# EAGLE schematic ESP8266_MySensorsGateway_v1.3 (EAGLE 7.5.0)
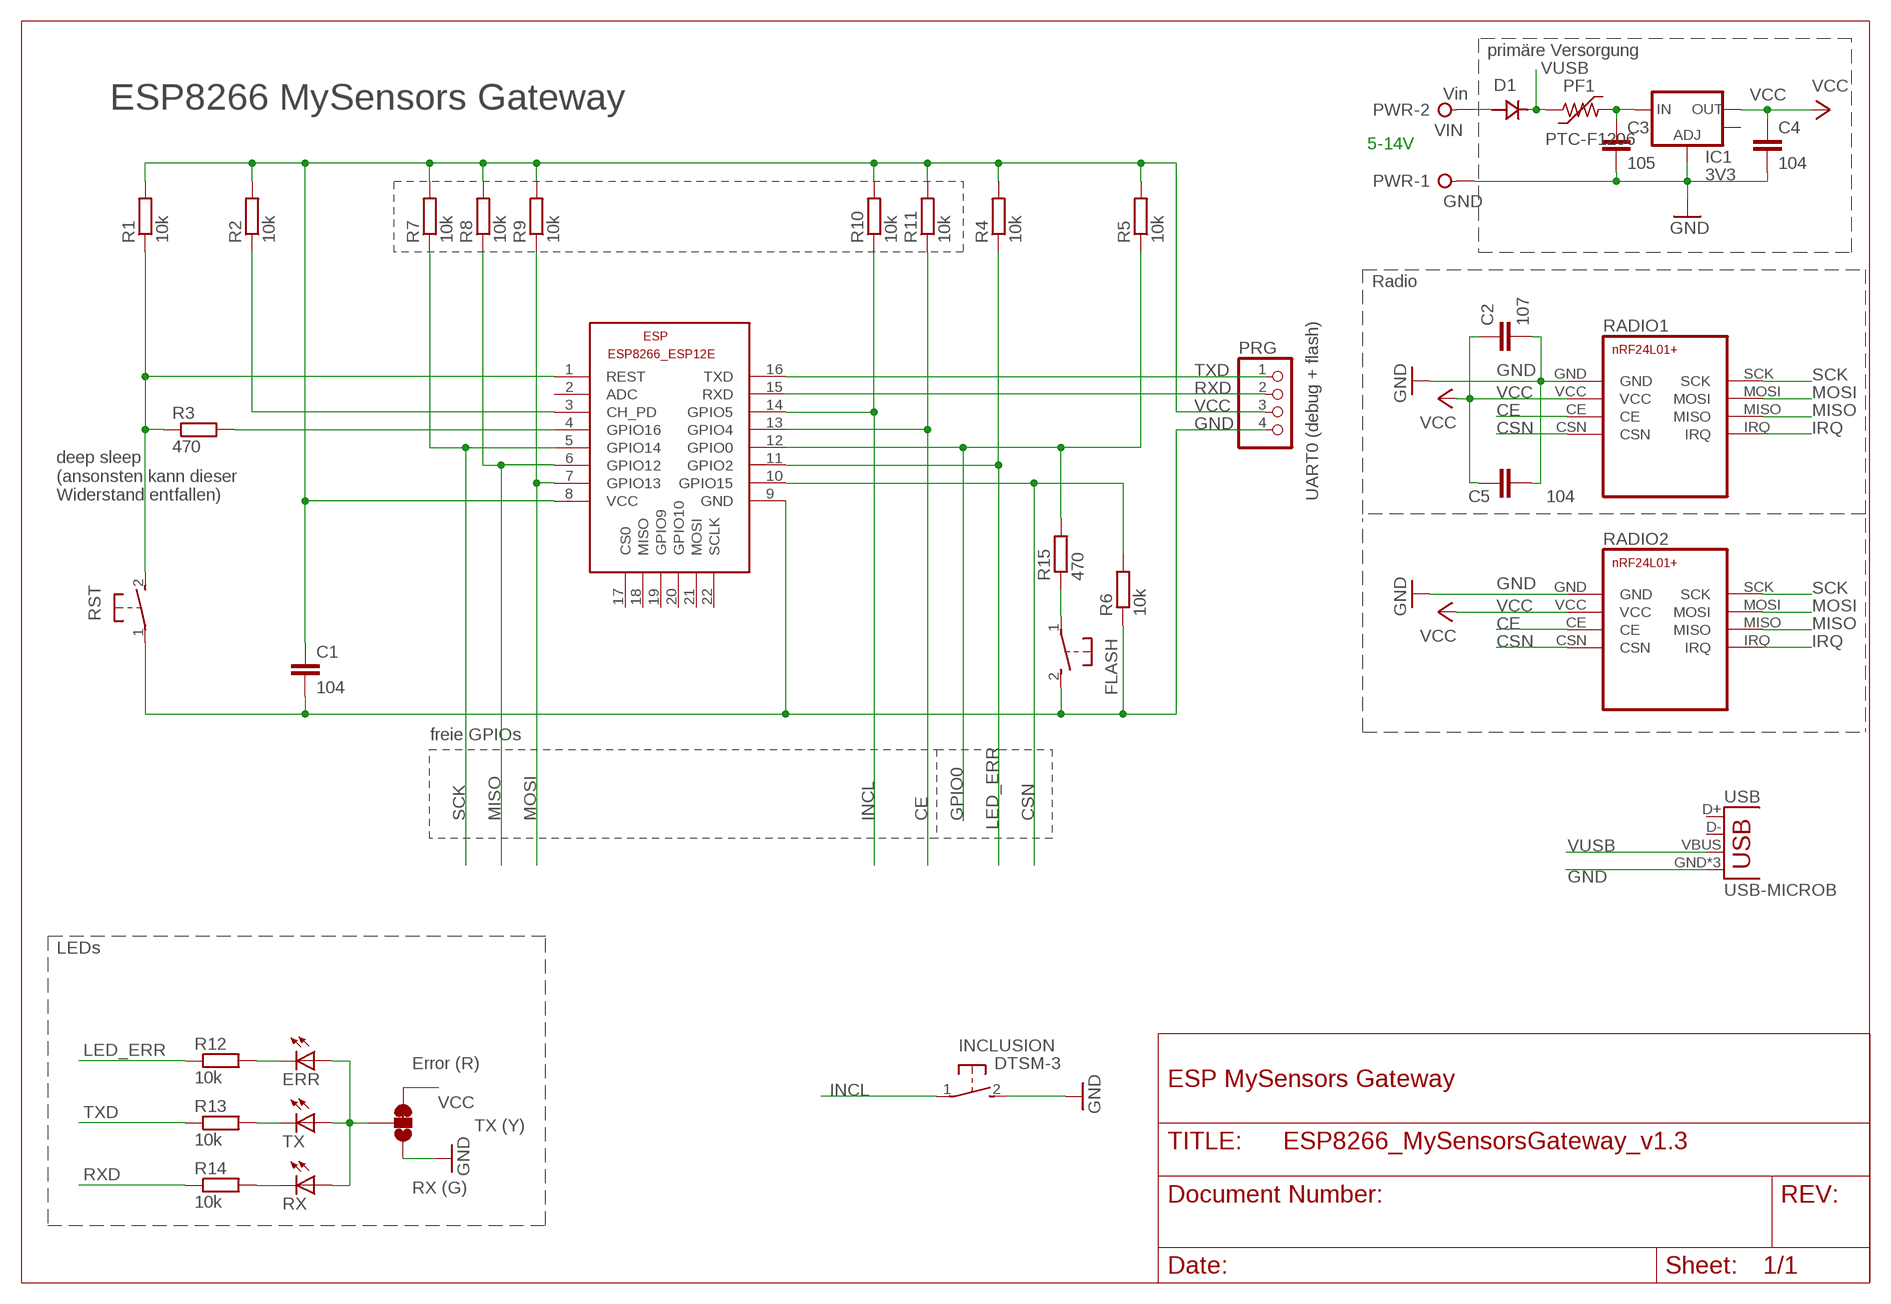
[diagram p0: schematic, sheet 1]

## Parts
C1  104  C-EUC0805  [C0805]
C2  107  C  [MY1210]
C3  105  C-EUC0805  [C0805]
C4  104  C-EUC0805  [C0805]
C5  104  C-EUC0805  [C0805]
D1  SS14  [DO214]
ERR  R  LEDCHIPLED_1206  [CHIPLED_1206]
ESP  µC  ESP8266-12EESP8266-ESP12E  [ESP8266-ESP12E]
FLASH  DTSM-3  [DTSM-3]
IC1  3V3  V_REG_LM1117SOT223  [SOT223]
INCLUSION  DTSM-3  [DTSM-3]
PF1  PTC-F1206  [F1206]
PRG  PINHD-1X4_S  [1X04]
PWR  Vin  W237-02P  [W237-132]
R1  10k  R-EU_R0805  [R0805]
R2  10k  R-EU_R0805  [R0805]
R3  470  R-EU_R0805  [R0805]
R4  10k  R-EU_R0805  [R0805]
R5  10k  R-EU_R0805  [R0805]
R6  10k  R-EU_R0805  [R0805]
R7  10k  R-EU_R0805  [R0805]
R8  10k  R-EU_R0805  [R0805]
R9  10k  R-EU_R0805  [R0805]
R10  10k  R-EU_R0805  [R0805]
R11  10k  R-EU_R0805  [R0805]
R12  10k  R-EU_R0805  [R0805]
R13  10k  R-EU_R0805  [R0805]
R14  10k  R-EU_R0805  [R0805]
R15  470  R-EU_R0805  [R0805]
RADIO1  NRF24L01+  [NRF24L01+]
RADIO2  NRF24L01+NRF24L01+MINI  [NRF24L01+MINI]
RST  DTSM-3  [DTSM-3]
RX  G  LEDCHIPLED_1206  [CHIPLED_1206]
SJ1  JUMPER-PAD-3-2OF3_NC_BY_TRACE_SMALL  [PAD-JUMPER-3-2OF3_NC_BY_TRACE_YES_SILK_FULL_BOX]
TX  Y  LEDCHIPLED_1206  [CHIPLED_1206]
USB  USB-MICROB  [USB-MICROB]

## Nets
CE: ESP.13(GPIO4) R11.1 RADIO1.CE RADIO2.CE
CH_PD: ESP.3(CH_PD) R2.1
CSN: ESP.10(GPIO15) R6.2 RADIO1.CSN RADIO2.CSN
DEEP_SLEEP: ESP.4(GPIO16) R3.2
GND: C1.2 C2.2 C3.2 C4.2 C5.2 ESP.9(GND) FLASH.2 IC1.1(ADJ) INCLUSION.2 PRG.4 PWR.1 R6.1 RADIO1.GND RADIO2.GND RST.1 SJ1.1 USB.GND USB.MT1(GND) USB.MT2(GND)
GPIO0: ESP.12(GPIO0) R5.1 R15.2
INCL: ESP.14(GPIO5) INCLUSION.1 R10.1
IRQ: RADIO1.IRQ RADIO2.IRQ
L_BASE: ERR.A RX.A SJ1.2 TX.A
LED_ERR: ESP.11(GPIO2) R4.1 R12.1
MISO: ESP.6(GPIO12) R8.1 RADIO1.MISO RADIO2.MISO
MOSI: ESP.7(GPIO13) R9.1 RADIO1.MOSI RADIO2.MOSI
N$4: ERR.C R12.2
N$5: R13.2 TX.C
N$6: R14.2 RX.C
N$7: FLASH.1 R15.1
N$10: C3.1 IC1.3(IN) PF1.2
RST: ESP.1(REST) R1.1 R3.1 RST.2
RXD: ESP.15(RXD) PRG.2 R14.1
SCK: ESP.5(GPIO14) R7.1 RADIO1.SCK RADIO2.SCK
TXD: ESP.16(TXD) PRG.1 R13.1
VCC: C1.1 C2.1 C4.1 C5.1 ESP.8(VCC) IC1.2(OUT) PRG.3 R1.2 R2.2 R4.2 R5.2 R7.2 R8.2 R9.2 R10.2 R11.2 RADIO1.VCC RADIO2.VCC SJ1.3
VIN: D1.ANODE PWR.2
VUSB: D1.CATHODE PF1.1 USB.VBUS
Unconnected: ESP.2(ADC) ESP.17(CS0) ESP.18(MISO) ESP.19(GPIO9) ESP.20(GPIO10) ESP.21(MOSI) ESP.22(SCLK) IC1.4(OUT) USB.D+ USB.D-

## Notes on the sheet
- primäre Versorgung
- ESP8266 MySensors Gateway
- 5-14V
- Radio
- deep sleep
  (ansonsten kann dieser 
  Widerstand entfallen)
- UART0 (debug + flash)
- freie GPIOs
- LEDs
- Error (R)
- ESP MySensors Gateway
- TX (Y)
- RX (G)

## Library data of the parts
C1 C3-C5 = resistor:C-EU: CAPACITOR, European symbol
C2 = my:C: CAPACITOR, European symbol
D1 = ihpcb-diode:SS14
ERR RX TX = led:LED: LED OSRAM: - CHIPLED LG R971, LG N971, LY N971, LG Q971, LY Q971, LO R971, LY R971 LH N974, LH R974 LS Q976, LO Q976, LY Q976 LO Q996 - Hyper CHIPLED LW Q18S LB Q993, LB Q99A, LB R99A - SideLED LS A670, LO A670, LY A670, LG A670, LP A670 LB A673, LV A673, LT A673, LW A673 LH A674 LY A675 LS A676, LA A676, LO A676, LY A676, LW A676 LS A679, LY A679, LG A679 - Hyper Micro SIDELED® LS Y876, LA Y876, LO Y876, LY Y876 LT Y87S - SmartLED LW L88C, LW L88S LB L89C, LB L89S, LG L890 LS L89K, LO L89K, LY L89K LS L896, LA L896, LO L896, LY L896 - TOPLED LS T670, LO T670, LY T670, LG T670, LP T670 LSG T670, LSP T670, LSY T670, LOP T670, LYG T670 LG T671, LOG T671, LSG T671 LB T673, LV T673, LT T673, LW T673 LH T674 LS T676, LA T676, LO T676, LY T676, LB T676, LH T676, LSB T676, LW T676 LB T67C, LV T67C, LT T67C, LS T67K, LO T67K, LY T67K, LW E67C LS E67B, LA E67B, LO E67B, LY E67B, LB E67C, LV E67C, LT E67C LW T67C LS T679, LY T679, LG T679 LS T770, LO T770, LY T770, LG T770, LP T770 LB T773, LV T773, LT T773, LW T773 LH T774 LS E675, LA E675, LY E675, LS T675 LS T776, LA T776, LO T776, LY T776, LB T776 LHGB T686 LT T68C, LB T68C - Hyper Mini TOPLED® LB M676 - Mini TOPLED Santana® LG M470 LS M47K, LO M47K, LY M47K Source: http://www.osram.convergy.de LUXEON: - LUMILED® LXK2-PW12-R00, LXK2-PW12-S00, LXK2-PW14-U00, LXK2-PW14-V00 LXK2-PM12-R00, LXK2-PM12-S00, LXK2-PM14-U00 LXK2-PE12-Q00, LXK2-PE12-R00, LXK2-PE12-S00, LXK2-PE14-T00, LXK2-PE14-U00 LXK2-PB12-K00, LXK2-PB12-L00, LXK2-PB12-M00, LXK2-PB14-N00, LXK2-PB14-P00, LXK2-PB14-Q00 LXK2-PR12-L00, LXK2-PR12-M00, LXK2-PR14-Q00, LXK2-PR14-R00 LXK2-PD12-Q00, LXK2-PD12-R00, LXK2-PD12-S00 LXK2-PH12-R00, LXK2-PH12-S00 LXK2-PL12-P00, LXK2-PL12-Q00, LXK2-PL12-R00 Source: www.luxeon.com KINGBRIGHT: KA-3528ASYC Source: www.kingbright.com
ESP = ESP8266-ESP12E:ESP8266-12E: ESP8266-12E with additional I/O and GPIO04/05 corrected The author cannot warrant that this library is free from error or will meet your specific requirements. Created by PuceBaboon.com. Komagane, Nagano, JAPAN
FLASH INCLUSION RST = mechanics:DTSM-3: Diptronics SMD button 6x3.5 mm
IC1 = SparkFun-PowerIC:V_REG_LM1117: Voltage Regulator LM1117 Standard adjustable voltage regulator but in SMD form. Spark Fun Electronics SKU : COM-00595; PROD_ID: VREG-08170
PF1 = polyswitch:PTC-: POLYSWITCH Polyswitch Resetable Fuses
PRG = my:PINHD-1X4_S: PIN HEADER
PWR = my:W237-02P: WAGO SREW CLAMP; OC_FARNELL: unknown; OC_NEWARK: unknown
R1-R11 R15 = resistor:R-EU_: RESISTOR, European symbol
R12-R14 = rcl:R-EU_: RESISTOR, European symbol
RADIO1 RADIO2 = my:NRF24L01+: nRF24L01+ Transceiver Module
SJ1 = SparkFun-Passives:JUMPER-PAD-3-2OF3_NC_BY_TRACE
USB = SparkFun-Connectors:USB: USB Connectors USB-B-PTH is fully proven SKU : PRT-00139/CONN-08278 USB-miniB is fully proven SKU : PRT-00587 USB-A-PCB is untested. USB-A-H is throughly reviewed, but untested. Spark Fun Electronics SKU : PRT-00437 USB-B-SMT is throughly reviewed, but untested. Needs silkscreen touching up. USB-A-S has not been used/tested USB-MB-H has not been used/tested USB-MICROB has been used. CONN-09505; PROD_ID: CONN-09505